# EAGLE design MG-Gadget mini (EAGLE 7.6.0)
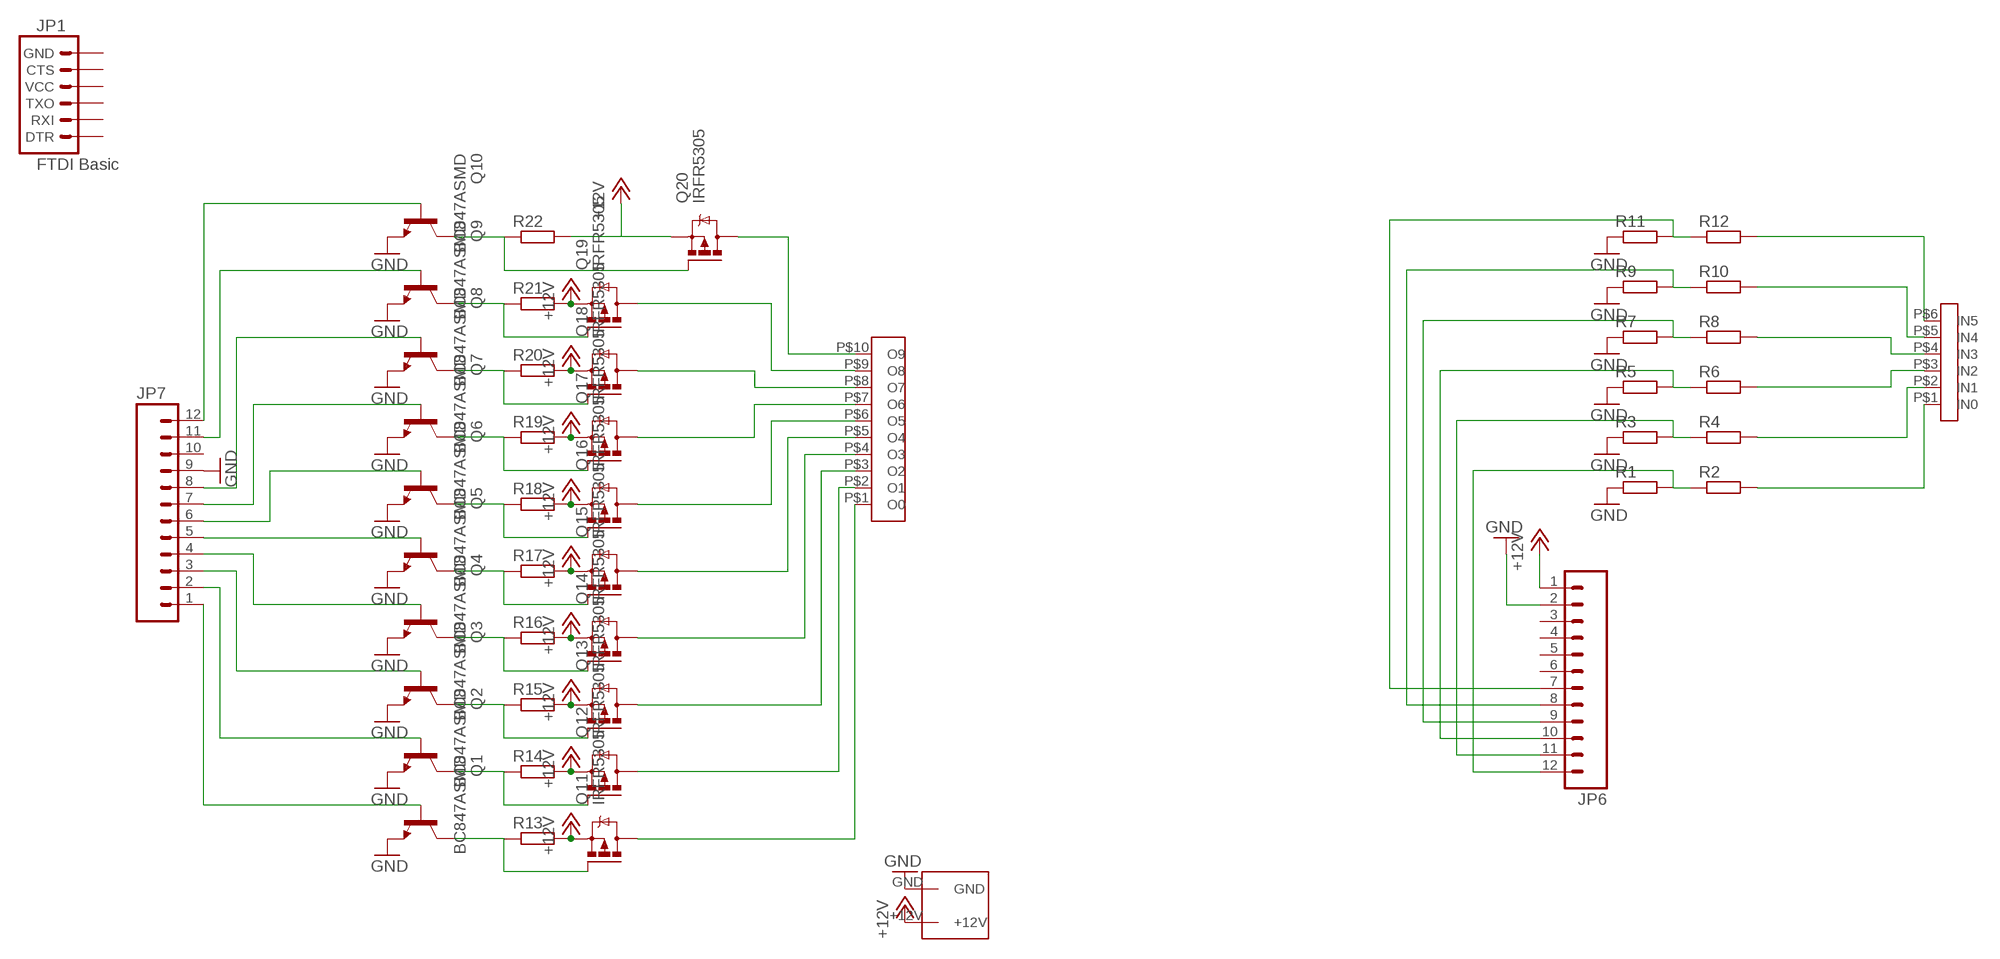
[diagram p0: schematic, sheet 1]

## Parts
JP1  FTDI Basic  ARDUINO_SERIAL_PROGRAMPTH  [1X06]
JP6  M12PTH  [1X12]
JP7  M12PTH  [1X12]
Q1  BC847ASMD  [SOT23]
Q2  BC847ASMD  [SOT23]
Q3  BC847ASMD  [SOT23]
Q4  BC847ASMD  [SOT23]
Q5  BC847ASMD  [SOT23]
Q6  BC847ASMD  [SOT23]
Q7  BC847ASMD  [SOT23]
Q8  BC847ASMD  [SOT23]
Q9  BC847ASMD  [SOT23]
Q10  BC847ASMD  [SOT23]
Q11  IRFR5305  [D-PAK_TO252AA]
Q12  IRFR5305  [D-PAK_TO252AA]
Q13  IRFR5305  [D-PAK_TO252AA]
Q14  IRFR5305  [D-PAK_TO252AA]
Q15  IRFR5305  [D-PAK_TO252AA]
Q16  IRFR5305  [D-PAK_TO252AA]
Q17  IRFR5305  [D-PAK_TO252AA]
Q18  IRFR5305  [D-PAK_TO252AA]
Q19  IRFR5305  [D-PAK_TO252AA]
Q20  IRFR5305  [D-PAK_TO252AA]
R1  R-EU_R0805  [R0805]
R2  R-EU_R0805  [R0805]
R3  R-EU_R0805  [R0805]
R4  R-EU_R0805  [R0805]
R5  R-EU_R0805  [R0805]
R6  R-EU_R0805  [R0805]
R7  R-EU_R0805  [R0805]
R8  R-EU_R0805  [R0805]
R9  R-EU_R0805  [R0805]
R10  R-EU_R0805  [R0805]
R11  R-EU_R0805  [R0805]
R12  R-EU_R0805  [R0805]
R13  R-EU_R0805  [R0805]
R14  R-EU_R0805  [R0805]
R15  R-EU_R0805  [R0805]
R16  R-EU_R0805  [R0805]
R17  R-EU_R0805  [R0805]
R18  R-EU_R0805  [R0805]
R19  R-EU_R0805  [R0805]
R20  R-EU_R0805  [R0805]
R21  R-EU_R0805  [R0805]
R22  R-EU_R0805  [R0805]
U$1  INTERMINAL  [INTERMINAL]
U$2  OUTTERMINAL  [OUTTERMINAL]
U$3  SUPPLYTERMINAL  [SUPPLYTERMINAL]

## Nets
+12V: JP6.1 Q11.3(S) Q12.3(S) Q13.3(S) Q14.3(S) Q15.3(S) Q16.3(S) Q17.3(S) Q18.3(S) Q19.3(S) Q20.3(S) R13.2 R14.2 R15.2 R16.2 R17.2 R18.2 R19.2 R20.2 R21.2 R22.2 U$3.+12V
GND: JP6.2 JP7.9 Q1.2(E) Q2.2(E) Q3.2(E) Q4.2(E) Q5.2(E) Q6.2(E) Q7.2(E) Q8.2(E) Q9.2(E) Q10.2(E) R1.1 R3.1 R5.1 R7.1 R9.1 R11.1 U$3.GND
N$1: JP6.12 R1.2 R2.1
N$2: JP6.11 R3.2 R4.1
N$3: R2.2 U$1.P$1(IN0)
N$4: R4.2 U$1.P$2(IN1)
N$5: Q1.3(C) Q11.1(G) R13.1
N$6: JP6.10 R5.2 R6.1
N$7: R6.2 U$1.P$3(IN2)
N$8: R8.2 U$1.P$4(IN3)
N$9: R10.2 U$1.P$5(IN4)
N$10: R12.2 U$1.P$6(IN5)
N$11: JP6.7 R11.2 R12.1
N$12: JP6.8 R9.2 R10.1
N$13: JP6.9 R7.2 R8.1
N$14: Q2.3(C) Q12.1(G) R14.1
N$15: JP7.1 Q1.1(B)
N$16: JP7.2 Q2.1(B)
N$17: Q3.3(C) Q13.1(G) R15.1
N$18: Q4.3(C) Q14.1(G) R16.1
N$19: JP7.3 Q3.1(B)
N$20: JP7.4 Q4.1(B)
N$21: JP7.5 Q5.1(B)
N$22: JP7.6 Q6.1(B)
N$23: Q20.4(D) U$2.P$10(O9)
N$24: JP7.7 Q7.1(B)
N$25: JP7.8 Q8.1(B)
N$26: JP7.11 Q9.1(B)
N$27: JP7.12 Q10.1(B)
N$28: Q8.3(C) Q18.1(G) R20.1
N$29: Q10.3(C) Q20.1(G) R22.1
N$30: Q9.3(C) Q19.1(G) R21.1
N$31: Q7.3(C) Q17.1(G) R19.1
N$32: Q6.3(C) Q16.1(G) R18.1
N$33: Q5.3(C) Q15.1(G) R17.1
N$34: Q11.4(D) U$2.P$1(O0)
N$35: Q12.4(D) U$2.P$2(O1)
N$36: Q13.4(D) U$2.P$3(O2)
N$37: Q14.4(D) U$2.P$4(O3)
N$38: Q15.4(D) U$2.P$5(O4)
N$39: Q16.4(D) U$2.P$6(O5)
N$40: Q17.4(D) U$2.P$7(O6)
N$41: Q18.4(D) U$2.P$8(O7)
N$42: Q19.4(D) U$2.P$9(O8)
Unconnected: JP1.1(DTR) JP1.2(RXI) JP1.3(TXO) JP1.4(VCC) JP1.5(CTS) JP1.6(GND) JP6.3 JP6.4 JP6.5 JP6.6 JP7.10

## Library data of the parts
JP1 = SparkFun:ARDUINO_SERIAL_PROGRAM
JP6 JP7 = SparkFun:M12: Header 12 Standard 12-pin 0.1" header. Use with straight break away headers (SKU : PRT-00116), right angle break away headers (PRT-00553), swiss pins (PRT-00743), machine pins (PRT-00117), and female headers (PRT-00115).
Q1-Q10 = transistor-npn:BC847*: NPN Transistor
Q11-Q20 = transistor-power:IRF?5305: HEXFET Power MOSFET Source: http://www.irf.com/product-info/datasheets/data/irfr5305pbf.pdf
R1-R22 = rcl:R-EU_: RESISTOR, European symbol
U$1 = MG-Gadget Shield:INTERMINAL
U$2 = MG-Gadget Shield:OUTTERMINAL
U$3 = MG-Gadget Shield:SUPPLYTERMINAL

## Net classes
0 default: width 0.203 mm
1 vcc: width 0.254 mm

## Board
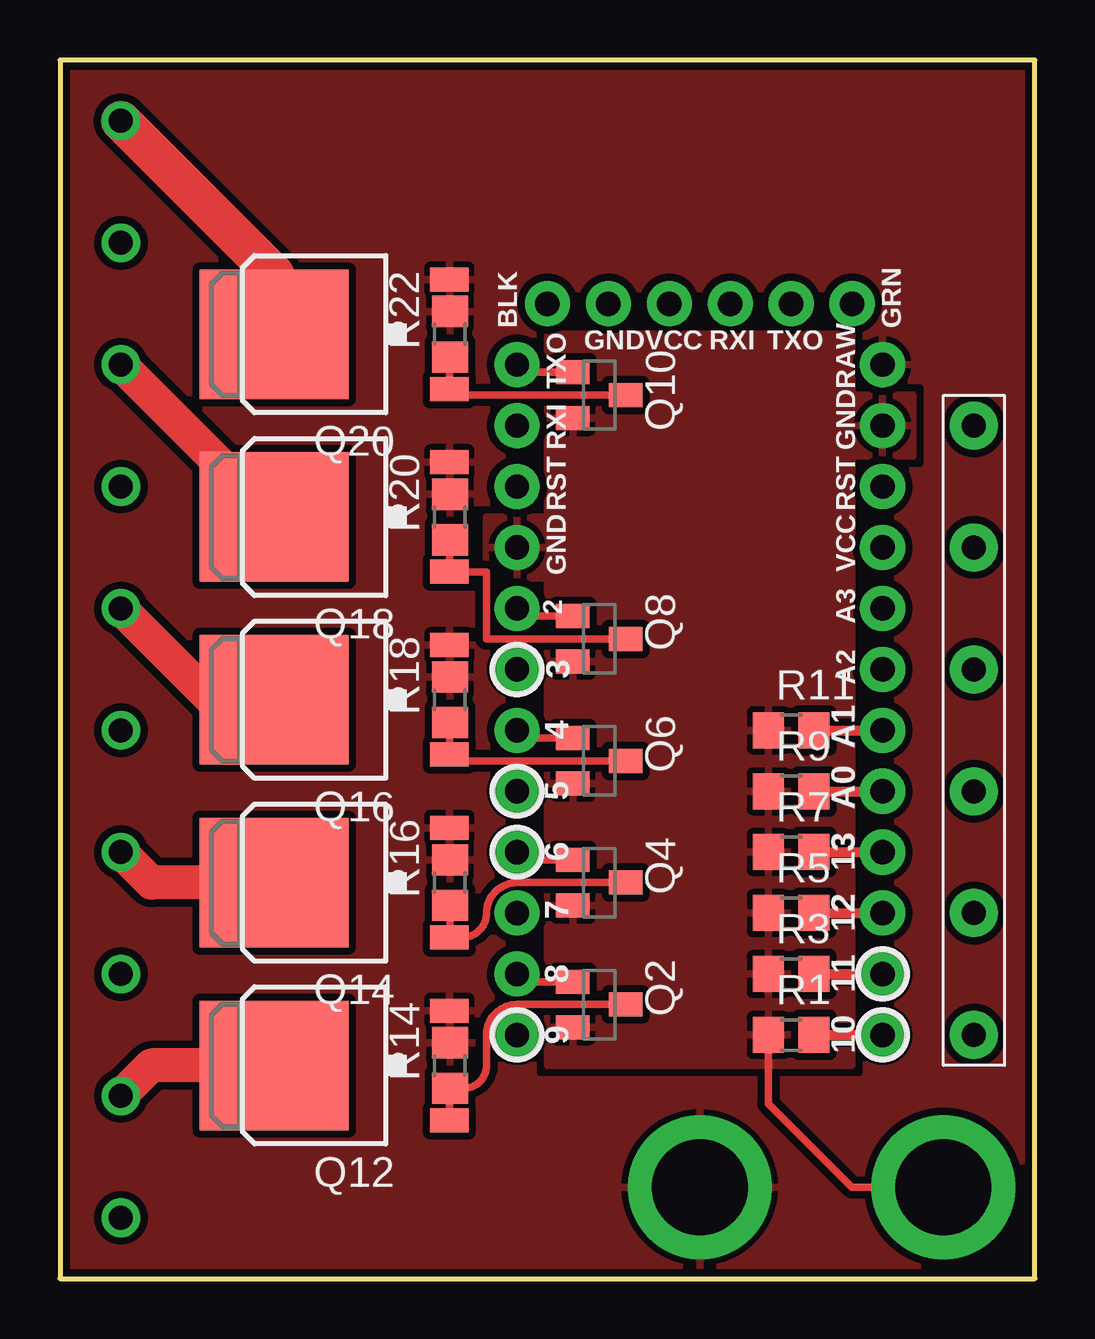
[diagram p1: board, top side]
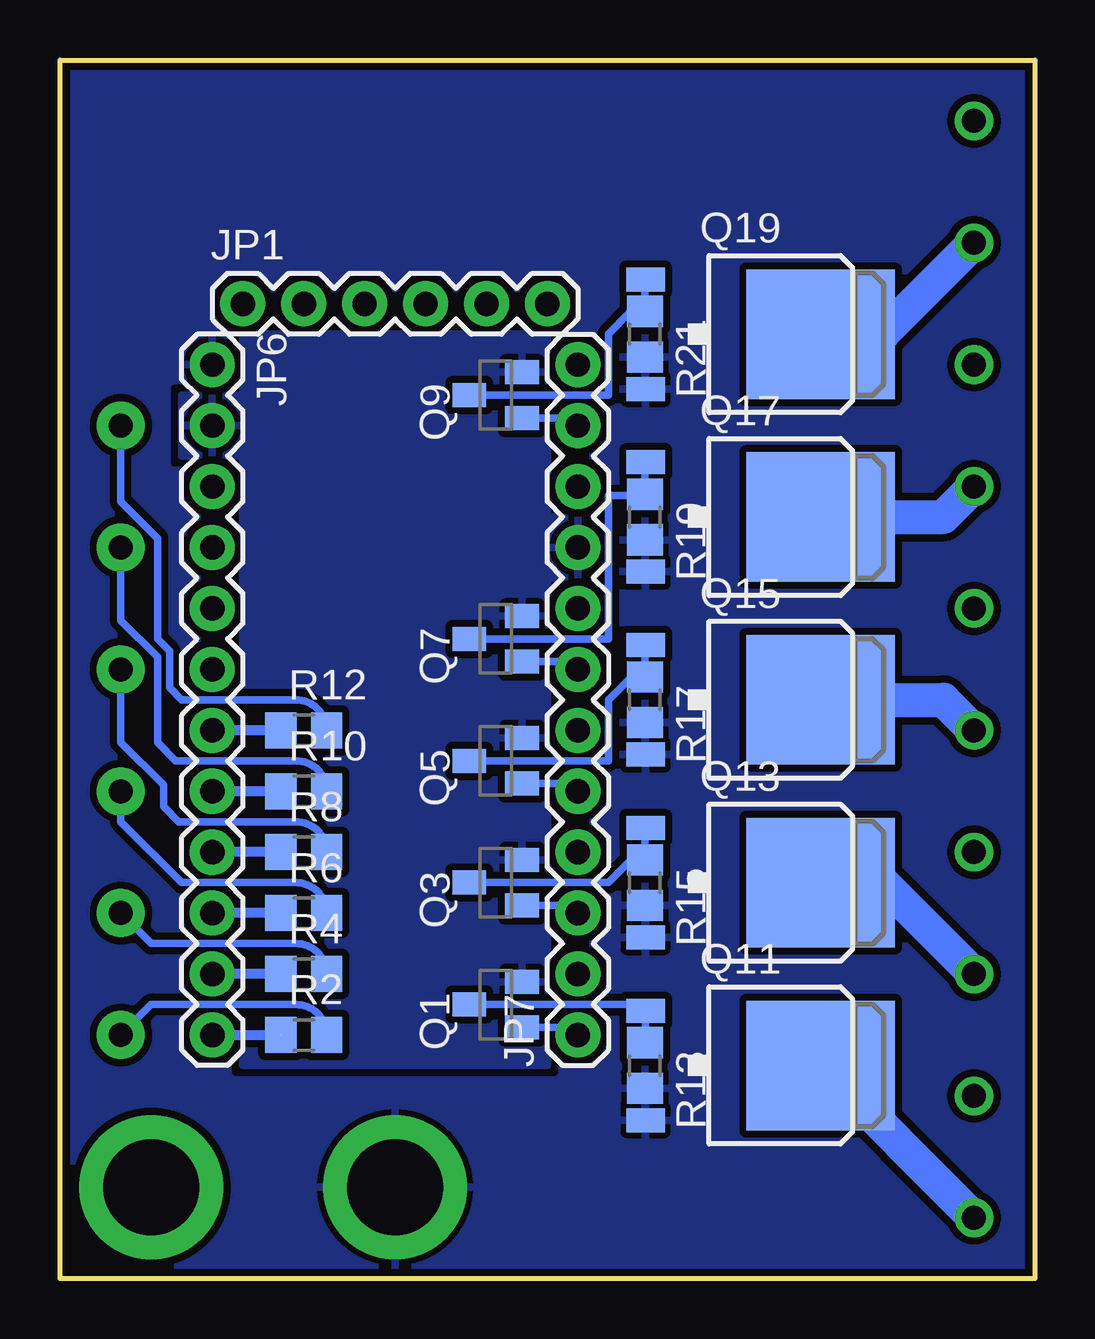
[diagram p2: board, bottom side, seen from below]

Size 40.64 x 50.8 mm. Coordinates in mm from the lower left corner, seen from the top.
Outline: 0,50.8 0,0 40.64,0 40.64,50.8 0,50.8
Copper layers (1*16): Top 0.035mm / dielectric 1.5mm / Bottom 0.035mm
Design rules "SparkFun-2-layer *": minimum track width 7mil, minimum drill 15mil, track to track 8mil, track to pad 8mil, pad to pad 8mil, via to via 8mil, smd to smd 8mil, copper to edge 8mil, drill to drill 8mil, minimum pad ring 12mil, minimum via ring 10mil, stop-mask expansion 4mil, vias tented up to drill 20mil, thermal gap 10mil

### Footprints (pad centres in the part's own frame; a part is rotated, then mirrored left to right if it is on the bottom)
1X06 = drill 1.016 pad 1.88: 1 0,0; 2 2.54,0; 3 5.08,0; 4 7.62,0; 5 10.16,0; 6 12.7,0
1X12 = drill 1.016 pad 1.88: 1 0,0; 2 2.54,0; 3 5.08,0; 4 7.62,0; 5 10.16,0; 6 12.7,0; 7 15.24,0; 8 17.78,0; 9 20.32,0; 10 22.86,0; 11 25.4,0; 12 27.94,0
SOT23 = smd 1 x 1.4: 1 -0.95,-1.1; 2 0.95,-1.1; 3 0,1.1
D-PAK_TO252AA = smd 1 x 1.6: 1 -2.28,-4.8; 3 2.28,-4.8 | smd 5.4 x 6.2: 4 0,2.5
R0805 = smd 1.3 x 1.5: 1 -0.95,0; 2 0.95,0
INTERMINAL = drill 1 pad 2: P$1 0,0; P$2 0,5.08; P$3 0,10.16; P$4 0,15.24; P$5 0,20.32; P$6 0,25.4
OUTTERMINAL = drill 1: P$1 0,0; P$2 0,5.08; P$3 0,10.16; P$4 0,15.24; P$5 0,20.32; P$6 0,25.4; P$7 0,30.48; P$8 0,35.56; P$9 0,40.64; P$10 0,45.72
SUPPLYTERMINAL = drill 4 pad 6: +12V 0,0; GND 0,10.16

### Placement (x,y rotation side)
JP1  33.02,40.64 0 bottom
JP6  34.29,38.1 270 bottom
JP7  19.05,10.16 90 bottom
Q1  22.48,11.43 90 bottom
Q2  22.48,11.43 270 top
Q3  22.48,16.51 90 bottom
Q4  22.48,16.51 270 top
Q5  22.48,21.59 90 bottom
Q6  22.48,21.59 270 top
Q7  22.48,26.67 90 bottom
Q8  22.48,26.67 270 top
Q9  22.48,36.83 90 bottom
Q10  22.48,36.83 270 top
Q11  11.43,8.89 270 bottom
Q12  11.43,8.89 90 top
Q13  11.43,16.51 270 bottom
Q14  11.43,16.51 90 top
Q15  11.43,24.13 270 bottom
Q16  11.43,24.13 90 top
Q17  11.43,31.75 270 bottom
Q18  11.43,31.75 90 top
Q19  11.43,39.37 270 bottom
Q20  11.43,39.37 90 top
R1  30.48,10.16 0 top
R2  30.48,10.16 0 bottom
R3  30.48,12.7 0 top
R4  30.48,12.7 0 bottom
R5  30.48,15.24 0 top
R6  30.48,15.24 0 bottom
R7  30.48,17.78 0 top
R8  30.48,17.78 0 bottom
R9  30.48,20.32 0 top
R10  30.48,20.32 0 bottom
R11  30.48,22.86 0 top
R12  30.48,22.86 0 bottom
R13  16.26,8.89 270 bottom
R14  16.26,8.89 90 top
R15  16.26,16.51 270 bottom
R16  16.26,16.51 90 top
R17  16.26,24.13 270 bottom
R18  16.26,24.13 90 top
R19  16.26,31.75 270 bottom
R20  16.26,31.75 90 top
R21  16.26,39.37 270 bottom
R22  16.26,39.37 90 top
U$1  38.1,10.16 0 top
U$2  2.54,2.54 0 top
U$3  26.67,3.81 270 top

### Tracks (layer width: path | path; a pad name or v marks a point on that pad's centre or on a via)
+12V
  pour Top (isolate 0.305, rank 2): 0,50.8 40.64,50.8 40.64,0 0,0
  pour Bottom (isolate 0.305, rank 2): 0,50.8 40.64,50.8 40.64,0 0,0
GND
  Top 0.305: R1.1 29.53,7.3 33.02,3.81 U$3.GND
  pour Bottom (isolate 0.305): 20.32,39.37 20.32,31.75 17.78,31.75 17.78,29.21 20.32,29.21 20.32,8.89 33.02,8.89 33.02,34.29 35.56,34.29 35.56,36.83 33.02,36.83 33.02,39.37
  pour Top (isolate 0.305): 20.32,39.37 33.02,39.37 33.02,36.83 35.56,36.83 35.56,34.29 33.02,34.29 33.02,8.89 20.32,8.89 20.32,29.21 17.78,29.21 17.78,31.75 20.32,31.75
N$1  (1 unrouted)
  Top 0.406: 31.75,10.16 JP6.12
  Bottom 0.406: JP6.12 R2.1
N$2
  Top 0.406: R4.1 JP6.11
  Bottom 0.406: R4.1 JP6.11
N$3
  Bottom 0.305: R2.2 arc-90 30.8,11.43 36.83,11.43 U$1.P$1
N$4
  Bottom 0.305: R4.2 arc-90 30.8,13.97 36.83,13.97 U$1.P$2
N$5
  Bottom 0.305: Q1.3 16.49,11.43 Q11.1 16.23,9.87 R13.1
N$6
  Top 0.406: R6.1 JP6.10
  Bottom 0.406: R6.1 JP6.10
N$7
  Bottom 0.305: R6.2 arc-90 30.8,16.51 35.56,16.51 38.1,19.05 U$1.P$3
N$8
  Bottom 0.305: R8.2 arc-90 30.8,19.05 35.69,19.05 36.32,19.68 36.32,20.57 38.1,22.35 U$1.P$4
N$9
  Bottom 0.305: R10.2 arc-90 30.8,21.59 35.81,21.59 36.58,22.35 36.58,25.91 38.1,27.43 U$1.P$5
N$10
  Bottom 0.305: R12.2 arc-90 30.8,24.13 35.56,24.13 36.07,24.64 36.07,26.16 36.58,26.67 36.58,30.86 38.1,32.38 U$1.P$6
N$11
  Top 0.406: R12.1 JP6.7
  Bottom 0.406: R12.1 JP6.7
N$12
  Top 0.406: R10.1 JP6.8
  Bottom 0.406: R10.1 JP6.8
N$13
  Top 0.406: R8.1 JP6.9
  Bottom 0.406: R8.1 JP6.9
N$14
  Top 0.305: Q2.3 19.05,11.43 arc90 17.78,10.16 17.78,8.89 arc-90 16.83,7.94 R14.1 arc90 16.23,7.91 Q12.1
N$15
  Bottom 0.305: Q1.1 19.37,10.48 JP7.1
N$16
  Top 0.305: Q2.1 19.37,12.38 JP7.2
N$17
  Bottom 0.305: Q3.3 17.78,16.51 16.89,17.4 16.32,17.4 R15.1 16.26,18.76 Q13.1
N$18
  Top 0.305: Q4.3 19.05,16.51 arc90 17.78,15.24 arc-90 16.77,14.23 Q14.1 arc90 16.26,14.26 R16.1
N$19
  Bottom 0.305: Q3.1 19.37,15.56 JP7.3
N$20
  Top 0.305: Q4.1 19.37,17.46 JP7.4
N$21
  Bottom 0.305: Q5.1 19.37,20.64 JP7.5
N$22
  Top 0.305: Q6.1 19.37,22.54 JP7.6
N$23
  Top 1.676: Q20.4 8.93,41.87 U$2.P$10
N$24
  Bottom 0.305: Q7.1 19.37,25.72 JP7.7
N$25
  Top 0.305: Q8.1 19.37,27.62 JP7.8
N$26
  Bottom 0.305: Q9.1 19.37,35.88 JP7.11
N$27
  Top 0.305: Q10.1 19.37,37.78 JP7.12
N$28
  Top 0.305: Q8.3 17.78,26.67 17.78,29.46 Q18.1 16.23,30.77 R20.1
N$29
  Top 0.305: R22.1 16.23,38.42 Q20.1 16.23,36.83 Q10.3
N$30
  Bottom 0.305: Q9.3 17.78,36.83 17.78,39.37 16.89,40.26 16.32,40.26 R21.1 16.26,41.62 Q19.1
N$31
  Bottom 0.305: Q7.3 17.78,26.67 17.78,32.64 16.32,32.64 R19.1 16.26,34 Q17.1
N$32
  Top 0.305: Q6.3 16.49,21.59 Q16.1 16.23,23.15 R18.1
N$33
  Bottom 0.305: Q5.3 17.78,21.59 17.78,24.13 16.51,25.4 16.51,25.33 R17.1 16.26,26.38 Q15.1
N$34
  Bottom 1.422: Q11.4 8.89,8.89 U$2.P$1
N$35
  Top 1.422: Q12.4 3.81,8.89 U$2.P$2
N$36
  Bottom 1.422: Q13.4 6.35,16.51 U$2.P$3
N$37
  Top 1.422: Q14.4 3.81,16.51 U$2.P$4
N$38
  Bottom 1.422: Q15.4 3.81,24.13 U$2.P$5
N$39
  Top 1.422: Q16.4 6.35,24.13 U$2.P$6
N$40
  Bottom 1.422: Q17.4 3.81,31.75 U$2.P$7
N$41
  Top 1.422: Q18.4 8.89,31.75 U$2.P$8
N$42
  Bottom 1.422: Q19.4 6.35,39.37 U$2.P$9

### Text on the board
tPlace: BLK | GRN | GND | VCC | RXI | TXO | TXO | RAW | RXI | GND | RST | RST | GND | VCC | 2 | A3 | 3 | A2 | 4 | A1 | 5 | A0 | 6 | 13 | 7 | 12 | 8 | 11 | 9 | 10